# Altium schematic sheet ADC.SchDoc: {Наименование}
size 420 x 297 mm; DocumentNumber: НРДЦ.ХХХХХХ.ХХХ ХХ; SheetNumber: {}; SheetTotal: {}; PageSetup: Record=PageOptions|CenterHorizontal=False|CenterVertical=False|PrintScale=0.95|XCorrection=0.00|YCorrection=0.00|PrintKind=1|BorderSize=5000000|LeftOffset=0|BottomOffset=0|Orientation=1|PaperLength=1000|PaperWidth=1000|Scale=100|PaperSource=15|PrintQuality=600|MediaType=1|DitherType=10|PaperKind=A4|PrintScaleMode=1; Rule: PcbType=ProtelPcb
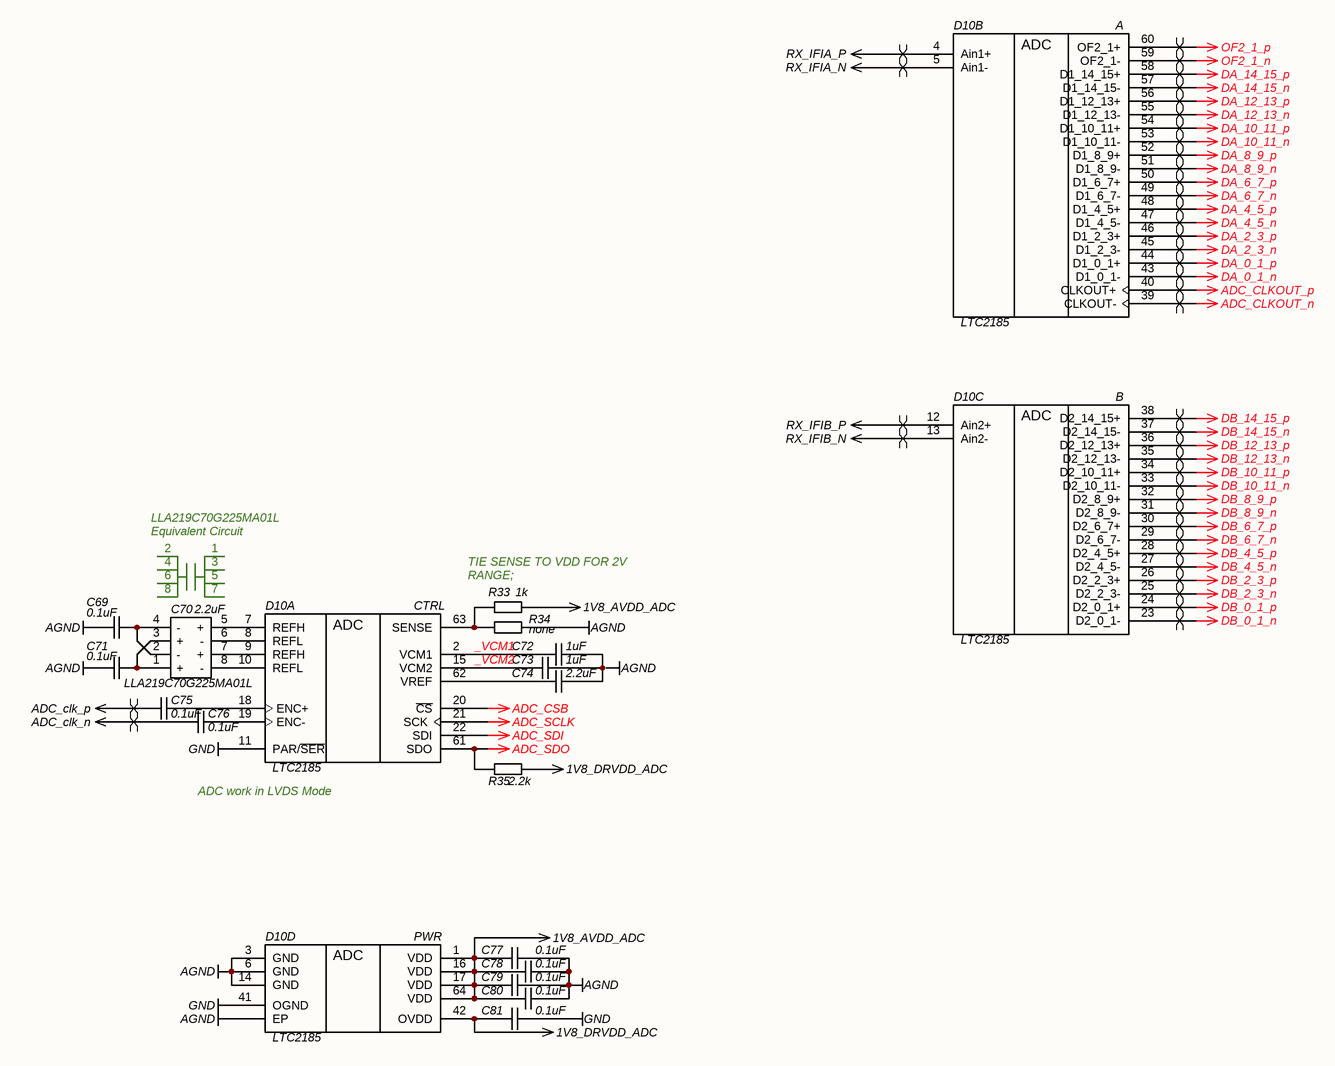
[diagram p0: ADC.SchDoc]

## Parts
C69  value 0.1uF  [C0402]  (hidden comment: CAP)
C70  LLA219C70G225MA01L  value 2.2uF  [Murata_LLA219-0_1_MFG]
C71  value 0.1uF  [C0402]  (hidden comment: CAP)
C72  value 1uF  [C0402]  (hidden comment: CAP)
C73  value 1uF  [C0402]  (hidden comment: CAP)
C74  value 2.2uF  [C0603]  (hidden comment: CAP)
C75  value 0.1uF  [C0402]  (hidden comment: CAP)
C76  value 0.1uF  [C0402]  (hidden comment: CAP)
C77  value 0.1uF  [C0402]  (hidden comment: CAP)
C78  value 0.1uF  [C0402]  (hidden comment: CAP)
C79  value 0.1uF  [C0402]  (hidden comment: CAP)
C80  value 0.1uF  [C0402]  (hidden comment: CAP)
C81  value 0.1uF  [C0402]  (hidden comment: CAP)
D10  LTC2185  [QFN-64]  (parts A,B,C,D of 4)
R33  value 1k  [R0402]  (hidden comment: RES)
R34  value none  [R0402]  (hidden comment: RES)
R35  value 2.2k  [R0402]  (hidden comment: RES)

## Nets
1V8_AVDD_ADC: C77.1 C78.1 C79.1 C80.1 D10.1(VDD) D10.16(VDD) D10.17(VDD) D10.64(VDD) R33.2
1V8_DRVDD_ADC: C81.2 D10.42(OVDD) R35.1
ADC_clk_n: C76.2
ADC_clk_p: C75.2
ADC_CLKOUT_n: D10.39(CLKOUT-)
ADC_CLKOUT_p: D10.40(CLKOUT+)
ADC_CSB: D10.20(~{CS})
ADC_SCLK: D10.21(SCK)
ADC_SDI: D10.22(SDI)
ADC_SDO: D10.61(SDO) R35.2
AGND: C69.1 C71.1 C77.2 C78.2 C79.2 C80.2 D10.0(EP) D10.3(GND) D10.6(GND) D10.14(GND) R34.2
DA_0_1_n: D10.43(D1_0_1-)
DA_0_1_p: D10.44(D1_0_1+)
DA_2_3_n: D10.45(D1_2_3-)
DA_2_3_p: D10.46(D1_2_3+)
DA_4_5_n: D10.47(D1_4_5-)
DA_4_5_p: D10.48(D1_4_5+)
DA_6_7_n: D10.49(D1_6_7-)
DA_6_7_p: D10.50(D1_6_7+)
DA_8_9_n: D10.51(D1_8_9-)
DA_8_9_p: D10.52(D1_8_9+)
DA_10_11_n: D10.53(D1_10_11-)
DA_10_11_p: D10.54(D1_10_11+)
DA_12_13_n: D10.55(D1_12_13-)
DA_12_13_p: D10.56(D1_12_13+)
DA_14_15_n: D10.57(D1_14_15-)
DA_14_15_p: D10.58(D1_14_15+)
DB_0_1_n: D10.23(D2_0_1-)
DB_0_1_p: D10.24(D2_0_1+)
DB_2_3_n: D10.25(D2_2_3-)
DB_2_3_p: D10.26(D2_2_3+)
DB_4_5_n: D10.27(D2_4_5-)
DB_4_5_p: D10.28(D2_4_5+)
DB_6_7_n: D10.29(D2_6_7-)
DB_6_7_p: D10.30(D2_6_7+)
DB_8_9_n: D10.31(D2_8_9-)
DB_8_9_p: D10.32(D2_8_9+)
DB_10_11_n: D10.33(D2_10_11-)
DB_10_11_p: D10.34(D2_10_11+)
DB_12_13_n: D10.35(D2_12_13-)
DB_12_13_p: D10.36(D2_12_13+)
DB_14_15_n: D10.37(D2_14_15-)
DB_14_15_p: D10.38(D2_14_15+)
GND: C81.1 D10.11(PAR/~{SER}) D10.41(OGND)
OF2_1_n: D10.59(OF2_1-)
OF2_1_p: D10.60(OF2_1+)
RX_IFIA_N: D10.5(Ain1-)
RX_IFIA_P: D10.4(Ain1+)
RX_IFIB_N: D10.13(Ain2-)
RX_IFIB_P: D10.12(Ain2+)
_VCM1: C72.2 D10.2(VCM1)
_VCM2: C73.2 D10.15(VCM2)
NetC69_2: C69.2 C70.2(-) C70.4(-)
NetC70_1: C70.1(+) C70.3(+) C71.2
NetC70_5: C70.5(+) D10.7(REFH)
NetC70_6: C70.6(-) D10.8(REFL)
NetC70_7: C70.7(+) D10.9(REFH)
NetC70_8: C70.8(-) D10.10(REFL)
NetC72_1: C72.1 C73.1 C74.1
NetC74_2: C74.2 D10.62(VREF)
NetC75_1: C75.1 D10.18(ENC+)
NetC76_1: C76.1 D10.19(ENC-)
NetD10_63: D10.63(SENSE) R33.1 R34.1

## Layout directives
differential pair: ADC_clk_n, ADC_clk_p, ADC_CLKOUT_n, ADC_CLKOUT_p, DA_0_1_n, DA_0_1_p, DA_2_3_n, DA_2_3_p, DA_4_5_n, DA_4_5_p, DA_6_7_n, DA_6_7_p, DA_8_9_n, DA_8_9_p, DA_10_11_n, DA_10_11_p, DA_12_13_n, DA_12_13_p, DA_14_15_n, DA_14_15_p, DB_0_1_n, DB_0_1_p, DB_2_3_n, DB_2_3_p, DB_4_5_n, DB_4_5_p, DB_6_7_n, DB_6_7_p, DB_8_9_n, DB_8_9_p, DB_10_11_n, DB_10_11_p, DB_12_13_n, DB_12_13_p, DB_14_15_n, DB_14_15_p, OF2_1_n, OF2_1_p, RX_IFIA_N, RX_IFIA_P, RX_IFIB_N, RX_IFIB_P

## Notes on the sheet
- LLA219C70G225MA01L
  Equivalent Circuit
- 2
- 4
- 6
- (near C70) 8
- 1
- 3
- 5
- (near C70) 7
- (near R33) TIE SENSE TO VDD FOR 2V RANGE;
  TIE SENSE TO GND FOR 1V RANGE;
- (near D10) ADC work in LVDS Mode Operation.
- Labels drawn without touching a wire or pin: AGND
- Подп. и дата
- Инв. № дубл.
- Взам. инв. №
- Инв. № подл.
- Лист
- Изм.
- № докум.
- Подп.
- Дата
- Копировал
- Формат А3
- (in symbol LTC2185, part A) CTRL; ADC
- (in symbol LTC2185, part B) A; ADC
- (in symbol LTC2185, part C) B; ADC
- (in symbol LTC2185, part D) PWR; ADC

## Library data of the parts
C69 C71 C75 C76 = CAP: SMD Capacitor; Manufacturer: Murata; Material: X7R; Tolerance: 10%; Voltage: 10V; Type: Ceramic Capacitor; P/N: GRM155R71A104KA01J
C70 = LLA219C70G225M: 0805 2.2 uF 4 V ±20 % Tolerance X7S Surface Mount Multilayer Ceramic Capacitor; Manufacturer: Murata; Tolerance: 20%; Voltage: 4V; Material: X7S; Type: Multilayer Ceramic Capacitor; Name: LLA219C70G225M; P/N: LLA219C70G225MA01L
C72 C73 = CAP: SMD Capacitor; Manufacturer: Murata; Material: X7R; Tolerance: 10%; Voltage: 6.3V; Type: Ceramic Capacitor; P/N: GRM155R70J105KA12D
C74 = CAP: SMD Capacitor; Manufacturer: Murata; Material: X7R; Tolerance: 10%; Voltage: 10V; Type: Ceramic Capacitor; P/N: GRM188R71A225KE15D
C77-C81 = CAP: SMD Capacitor; Manufacturer: Murata; Material: X7R; Tolerance: 10%; Voltage: 16V; Type: Ceramic Capacitor; P/N: GRM155R71C104KA88J
D10 = LTC2185: Dual 16-Bit, 125Msps  Low Power 3V ADC; Name: LTC2185CUP#PBF-ND; Power Dissipation: 370mW; Resolution: 16 Bits; Sampling Frequency: 125 MHz; Type: Dual 16-Bit, 105Msps  Low Power 3V ADC; Voltage: Single 1.8V Supply; Package: 64-Pin (9mm × 9mm) QFN; Temperature Range: 0°C to 70°C
R33 = RES: SMD Resistor; Manufacturer: Panasonic Electronic Components; Name: Chip SMD Resistor; Power: 0.062 Wt; Tolerance: 5%; P/N: ERJ-2GEJ102X; Temperature Range: -55…155°C
R34 = RES: SMD Resistor; Manufacturer: Panasonic Electronic Components; Name: Chip SMD Resistor; Power: 0.062 Wt; P/N: ERJ-2GE0R00X; Temperature Range: -55…155°C
R35 = RES: SMD Resistor; Name: Chip SMD Resistor; Power: 0.062 Wt; Tolerance: 5%; P/N: ERJ-2GEJ222X; Temperature Range: -55…155°C